# Altium schematic sheet Schematic.SchDoc: Thermo Board
size A3; Engineer: Domenico Spagnuolo; DocumentNumber: 1; SheetNumber: 1; SheetTotal: 1
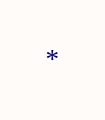
[diagram p0: Schematic.SchDoc]

## Parts
*  Title Block  (value not drawn)